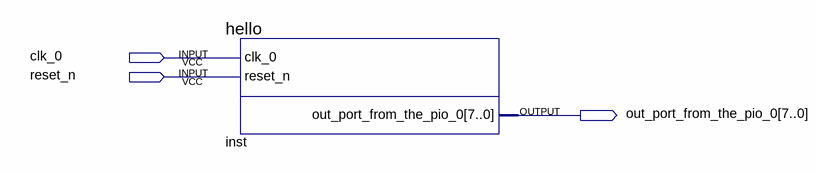
[diagram p0: schematic sheet]
// Quartus schematic Block1.bdf as structural Verilog: 1 symbols, 3 pins
module Block1 (
  input  clk_0,
  input  reset_n,
  output [7:0] out_port_from_the_pio_0
);

  hello inst (.clk_0(clk_0), .reset_n(reset_n), .out_port_from_the_pio_0(out_port_from_the_pio_0));
endmodule
